# EAGLE design IFB-40001-R02 - I2C_Encoder (EAGLE 9.6.2)
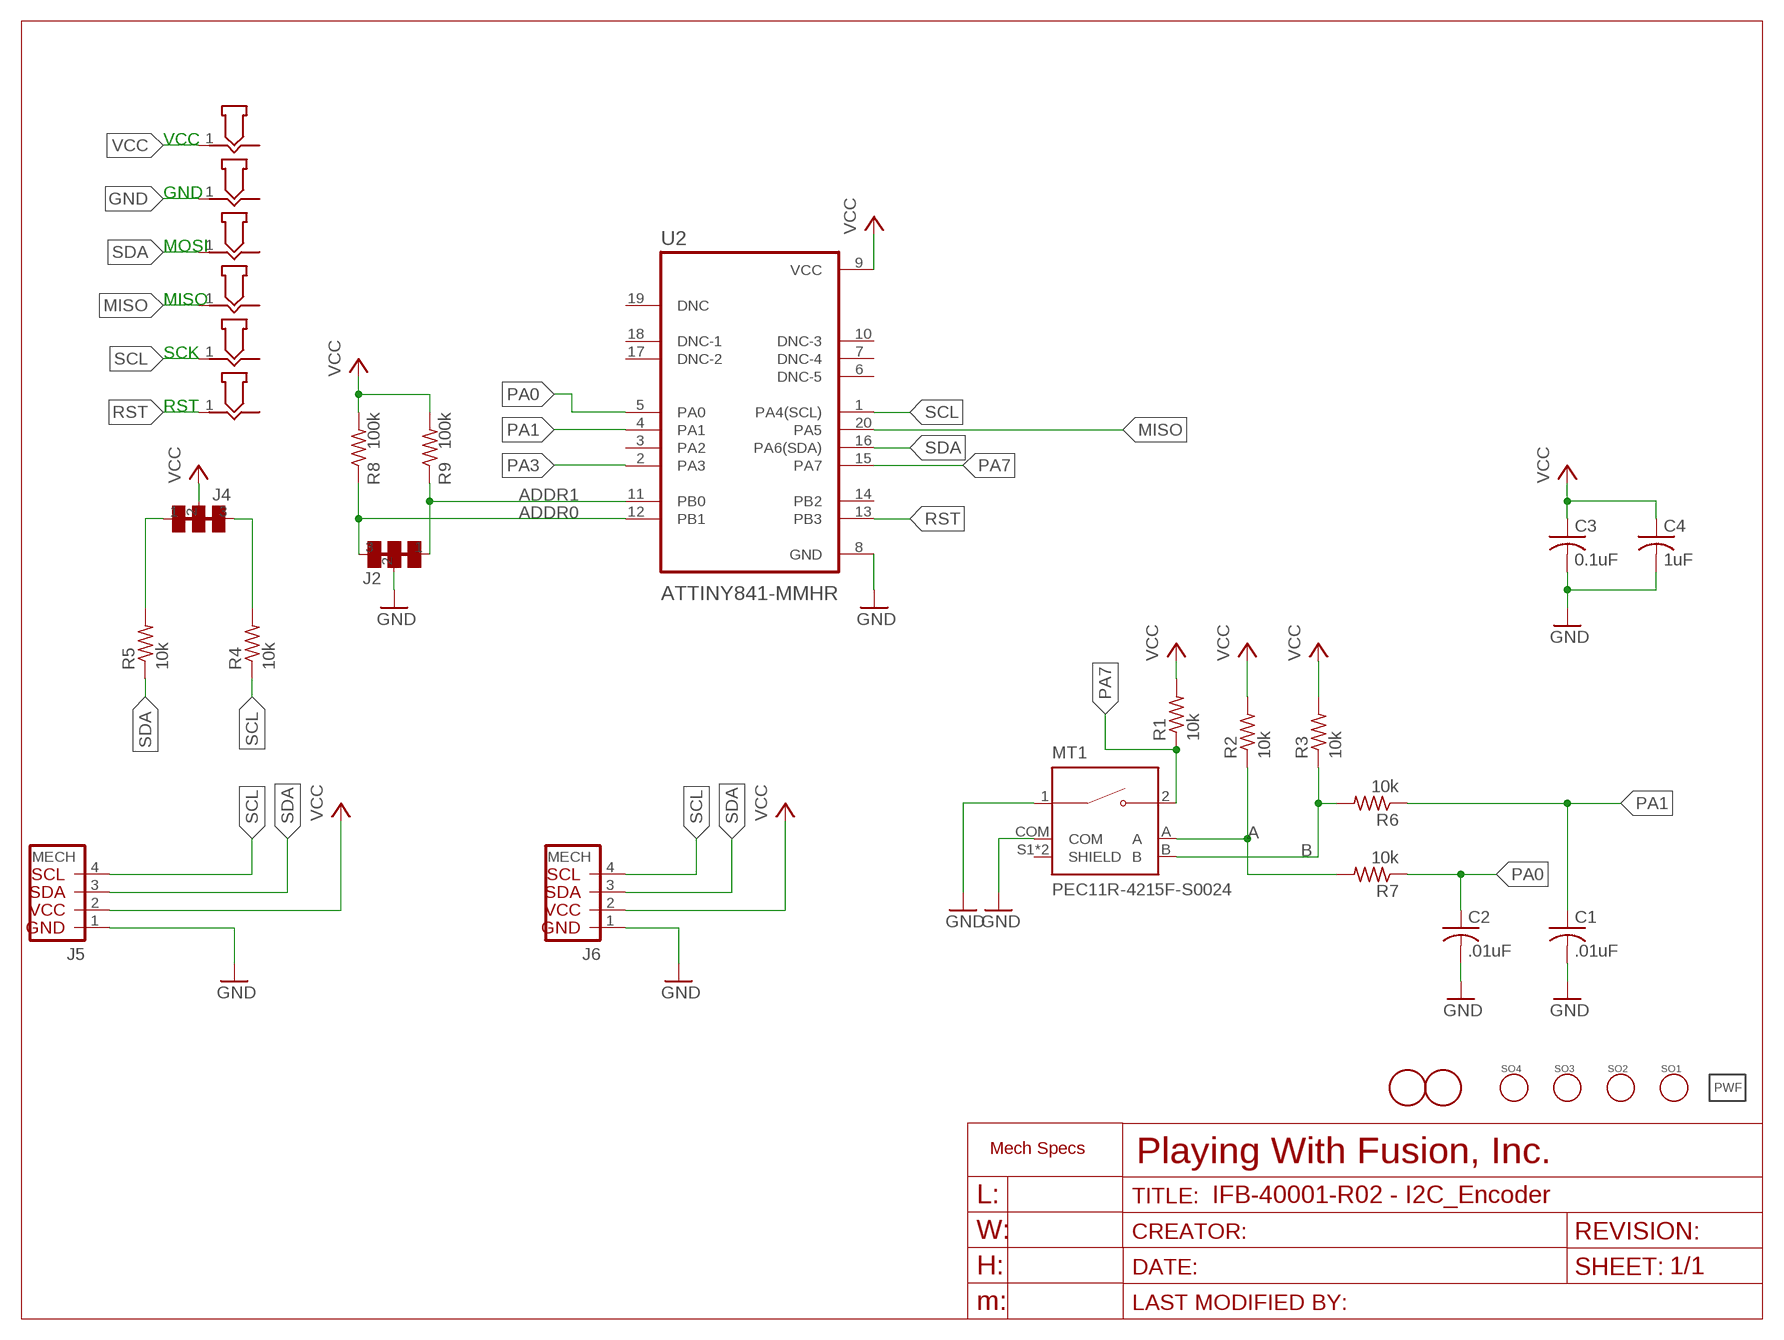
[diagram p0: schematic, sheet 1]

## Parts
C1  .01uF  C-USC0603K  [C0603K]
C2  .01uF  C-USC0603K  [C0603K]
C3  0.1uF  C-USC0603K  [C0603K]
C4  1uF  C-USC0603K  [C0603K]
GND  POGO_PAD  [P50_POGO_BOARD_CONTACT_12MIL]
J2  CUT_JUMPER_2X  [SMT_2X_CUTTABLE_JUMPER]
J4  CUT_JUMPER_2X  [SMT_2X_CUTTABLE_JUMPER]
J5  QWIICSIDE  [SM04B-SRSS-TB]
J6  QWIICSIDE  [SM04B-SRSS-TB]
LOGO1  PWF_LOGOPWF-5MM-SS  [LOGO_5MM_STEIN]
MISO  POGO_PAD  [P50_POGO_BOARD_CONTACT_12MIL]
MOSI  POGO_PAD  [P50_POGO_BOARD_CONTACT_12MIL]
MT1  PEC11R-4215F-S0024  [XDCR_PEC11R-4215F-S0024]
R1  10k  R-US_R0603  [R0603]
R2  10k  R-US_R0603  [R0603]
R3  10k  R-US_R0603  [R0603]
R4  10k  R-US_R0603  [R0603]
R5  10k  R-US_R0603  [R0603]
R6  10k  R-US_R0603  [R0603]
R7  10k  R-US_R0603  [R0603]
R8  100k  R-US_R0603  [R0603]
R9  100k  R-US_R0603  [R0603]
RST  POGO_PAD  [P50_POGO_BOARD_CONTACT_12MIL]
SCK  POGO_PAD  [P50_POGO_BOARD_CONTACT_12MIL]
SO1  STAND_OFFNO4_TIGHT  [STANDOFF_NO4_TIGHT]
SO2  STAND_OFFNO4_TIGHT  [STANDOFF_NO4_TIGHT]
SO3  STAND_OFFNO4_TIGHT  [STANDOFF_NO4_TIGHT]
SO4  STAND_OFFNO4_TIGHT  [STANDOFF_NO4_TIGHT]
U2  ATTINY841-MMHR  [QFN45P300X300X85-21N]
U$2  FIDUCIAL  [FIDUCIAL_1MM]
U$3  FIDUCIAL  [FIDUCIAL_1MM]
VCC  POGO_PAD  [P50_POGO_BOARD_CONTACT_12MIL]

## Nets
A: MT1.A R2.1 R7.2
ADDR0: J2.3 R8.1 U2.12(PB1)
ADDR1: J2.1 R9.1 U2.11(PB0)
B: MT1.B R3.1 R6.2
GND: C1.2 C2.2 C3.2 C4.2 GND.1 J2.2 J5.1 J6.1 MT1.1 MT1.COM U2.8(GND)
MISO: MISO.1 U2.20(PA5)
N$1: J4.1 R5.2
N$2: J4.3 R4.2
PA0: C2.1 R7.1 U2.5(PA0)
PA1: C1.1 R6.1 U2.4(PA1)
PA3: U2.2(PA3)
PA7: MT1.2 R1.1 U2.15(PA7)
RST: RST.1 U2.13(PB3)
SCL: J5.4 J6.4 R4.1 SCK.1 U2.1(PA4(SCL))
SDA: J5.3 J6.3 MOSI.1 R5.1 U2.16(PA6(SDA))
VCC: C3.1 C4.1 J4.2 J5.2 J6.2 R1.2 R2.2 R3.2 R8.2 R9.2 U2.9(VCC) VCC.1
Unconnected: J5.MECH1(MECH) J5.MECH2(MECH) J6.MECH1(MECH) J6.MECH2(MECH) MT1.S1(SHIELD) MT1.S2(SHIELD) U2.3(PA2) U2.6(DNC-5) U2.7(DNC-4) U2.10(DNC-3) U2.14(PB2) U2.17(DNC-2) U2.18(DNC-1) U2.19(DNC)

## Notes on the sheet
- VCC
- GND
- MOSI
- MISO
- SCK
- RST

## Library data of the parts
C1-C4 = rcl:C-US: CAPACITOR, American symbol; SPICEPREFIX: C
GND MISO MOSI RST SCK VCC = PlayingWithFusion_Breakout-Lib:POGO_PAD
J2 J4 = PlayingWithFusion_Breakout-Lib:CUT_JUMPER_2X
J5 J6 = PlayingWithFusion_JST:QWIIC
LOGO1 = PlayingWithFusion_Logo:PWF_LOGO
MT1 = PlayingWithFusion_Bourns:PEC11R-4215F-S0024: Incremental Encoder, 12 Mm, Contact Rating 10 Ma - 5 Vdc Check availability <https://pricing.snapeda.com/parts/PEC11R-4215F-S0024/Bourns/view-part?ref=eda>; AVAILABILITY: In Stock; DESCRIPTION: Rotary Encoder Mechanical 24 Quadrature (Incremental) Vertical; MF: Bourns; MP: PEC11R-4215F-S0024; PACKAGE: None; PRICE: None; PURCHASE-URL: https://pricing.snapeda.com/search/part/PEC11R-4215F-S0024/?ref=eda
R1-R9 = rcl:R-US_: RESISTOR, American symbol; SPICEPREFIX: R
SO1-SO4 = PlayingWithFusion_Breakout-Lib:STAND_OFF: Stand Off This is the mechanical footprint for a #4 phillips button head screw. Use the keepout ring to avoid running the screw head into surrounding components. SKU : PRT-00447
U2 = ATTINY841-MMHR:ATTINY841-MMHR: None Check availability <https://pricing.snapeda.com/parts/ATTINY841-MMHR/Microchip/view-part?ref=eda>; AVAILABILITY: In Stock; DESCRIPTION: AVR AVR® ATtiny Microcontroller IC 8-Bit 16MHz 8KB (8K x 8) FLASH 20-VQFN (3x3); MF: Microchip; MP: ATTINY841-MMHR; PACKAGE: DFN-20 Microchip; PRICE: None; PURCHASE-URL: https://pricing.snapeda.com/search/part/ATTINY841-MMHR/?ref=eda
U$2 U$3 = PlayingWithFusion_Breakout-Lib:FIDUCIAL: For use by pick and place machines to calibrate the vision/machine, 1mm By microbuilder.eu

## Board
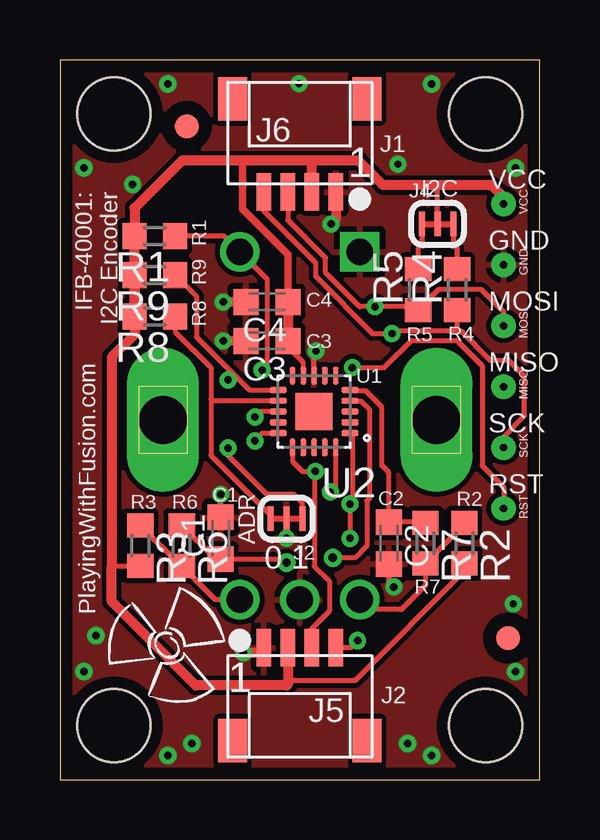
[diagram p1: board, top side]
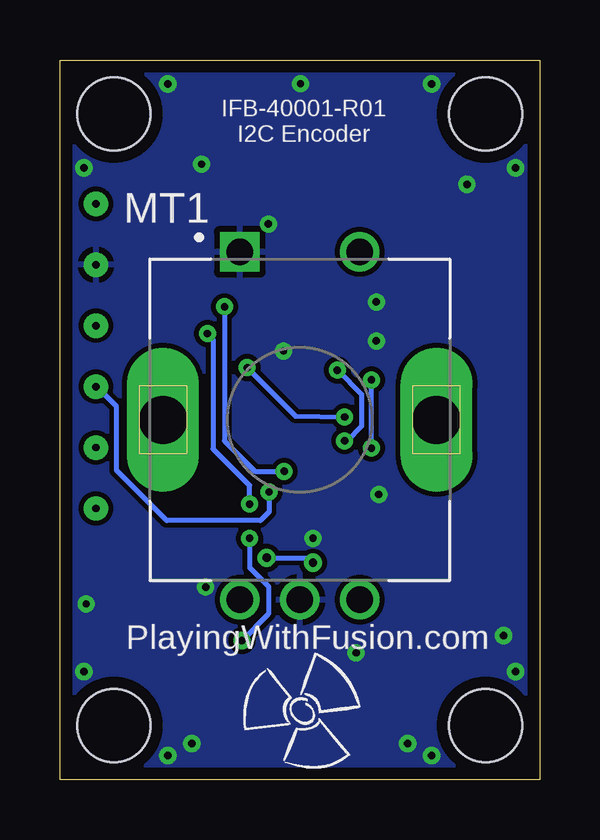
[diagram p2: board, bottom side, seen from below]

Size 20 x 30 mm. Coordinates in mm from the lower left corner, seen from the top.
Outline: 0,0 20,0 20,30 0,30 0,0
Copper layers (1*16): Top 0.035mm / dielectric 1.5mm / Bottom 0.035mm
Design rules "default *": minimum track width 8mil, minimum drill 12mil, track to track 8mil, track to pad 8mil, pad to pad 8mil, via to via 8mil, smd to smd 8mil, copper to edge 20mil, drill to drill 6mil, minimum pad ring 10mil, minimum via ring 8mil, stop-mask expansion 4mil, vias tented up to drill 17mil, thermal gap 10mil

### Footprints (pad centres in the part's own frame; a part is rotated, then mirrored left to right if it is on the bottom)
C0603K = smd 1.05 x 1.08: 1 -0.875,0; 2 0.875,0
P50_POGO_BOARD_CONTACT_12MIL = drill 0.305 pad 1.016: 1 0,0
SMT_2X_CUTTABLE_JUMPER = smd 0.254 x 1.016: 1 -0.66,0; 2 0,0; 3 0.66,0
SM04B-SRSS-TB = smd 0.6 x 1.55: 1 1.5,0; 2 0.5,0; 3 -0.5,0; 4 -1.5,0 | smd 1.2 x 1.8: MECH1 2.8,3.875; MECH2 -2.8,3.875
XDCR_PEC11R-4215F-S0024 = drill 1.1 square: 1 -2.5,7 | drill 1.1: 2 2.5,7; A -2.5,-7.5; B 2.5,-7.5; COM 0,-7.5 | drill 2 long: S1 -5.7,0; S2 5.7,0
R0603 = smd 1 x 1.1: 1 -0.85,0; 2 0.85,0
STANDOFF_NO4_TIGHT = hole 3.048: 0,0
QFN45P300X300X85-21N = smd 0.72 x 0.24: 1 -1.495,0.9; 2 -1.495,0.45; 3 -1.495,0; 4 -1.495,-0.45; 5 -1.495,-0.9; 11 1.495,-0.9; 12 1.495,-0.45; 13 1.495,0; 14 1.495,0.45; 15 1.495,0.9 | smd 0.24 x 0.72: 6 -0.9,-1.495; 7 -0.45,-1.495; 8 0,-1.495; 9 0.45,-1.495; 10 0.9,-1.495; 16 0.9,1.495; 17 0.45,1.495; 18 0,1.495; 19 -0.45,1.495; 20 -0.9,1.495 | smd 1.55 x 1.55: 21 0,0
FIDUCIAL_1MM = smd 1 x 1: 1 0,0

### Placement (x,y rotation side)
C1  6.71,10.06 90 top
C2  13.72,9.86 270 top
C3  8.64,18.29 180 top
C4  8.64,19.91 180 top
GND  18.5,21.46 0 top
J2  9.45,10.87 180 top
J4  15.75,23.16 0 top
J5  10,5.5 180 top
J6  10,24.5 0 top
LOGO1  4.44,5.61 0 top
LOGO2  PWF_LOGOPWF-6MM-SS  [LOGO_5MM_STEIN]  9.92,2.87 0 bottom
MISO  18.5,16.38 0 top
MOSI  18.5,18.92 0 top
MT1  10,15 0 bottom
R1  3.96,22.66 180 top
R2  16.87,9.86 270 top
R3  3.35,9.75 270 top
R4  16.56,20.42 90 top
R5  14.94,20.42 90 top
R6  5.08,9.75 270 top
R7  15.24,9.86 270 top
R8  3.96,19.3 180 top
R9  3.96,21.03 180 top
RST  18.5,11.3 0 top
SCK  18.5,13.84 0 top
SO1  17.75,2.25 0 top
SO2  2.25,2.25 0 top
SO3  2.25,27.75 0 top
SO4  17.75,27.75 0 top
U2  10.6,15.34 180 top
U$2  5.28,27.23 0 top
U$3  18.69,5.89 0 top
VCC  18.5,24 0 top

### Tracks (layer width: path | path; a pad name or v marks a point on that pad's centre or on a via)
A
  Top 0.203: R2.1 16.87,10.63 R7.2 15.24,8.09 14.24,7.09 12.91,7.09 MT1.A
ADDR0
  Top 0.203: J2.3 8.79,11.02 6.3,13.51 6.3,15.85 | R8.1 4.81,18.66 6.3,17.17 6.3,15.85 | 6.3,15.85 6.36,15.79 U2.12
ADDR1  (via drill 0.3)
  Top 0.203: R9.1 5.69,20.15 5.69,18.46 7.25,16.9 | 7.25,16.9 7.9,16.24 U2.11 | J2.1 10.11,11.53 9.75,11.89 8.64,11.89 7.01,13.51 v7.01,13.82 | v7.01,16.66 7.25,16.9
  Bottom 0.203: v7.01,13.82 v7.01,16.66
B
  Top 0.203: R3.1 5.05,8.9 R6.2 6.48,7.5 MT1.B
GND  (via drill 0.3)
  Top 0.203: U2.8 10.6,17.78 v10.68,17.86 | C1.2 v6.71,11.89 | v13.92,8.03 13.72,8.23 C2.2 | J2.2 v9.45,10.06
  Top 0.406: C4.2 v6.81,19.91 | C3.2 v6.81,18.29 | v11.31,23.16 11.5,23.36 J6.1 | J5.1 8.28,5.28 v7.65,5.28
  other vias: 1,25.5 3.02,24.81 4.5,29 9.97,29.01 15.5,29 14.09,25.66 19,25.5 1.5,6 1,4.5 4.5,1 5.5,1.5 15.5,1 14.5,1.5 19,4.5 18.91,7.32
  pour Bottom: 0,30 0,0 20,0 20,30
  pour Top: 0,30 0,0 20,0 20,30
MISO  (via drill 0.3)
  Top 0.203: U2.20 11.5,12.21 v11.28,11.99
  Bottom 0.203: v11.28,11.99 11.28,11.16 11.64,10.8 15.55,10.8 17.64,12.89 17.64,15.55 18.47,16.38 MISO.1
N$1
  Top 0.203: J4.1 15.09,22.3 14.94,22.15 R5.2
N$2
  Top 0.203: J4.3 16.41,22.3 16.56,22.15 R4.2
PA0
  Top 0.203: U2.5 12.12,16.22 12.74,16.22 13.41,15.54 13.41,13.11 13.72,12.8 C2.1 15.21,10.73 R7.1
PA1  (via drill 0.35)
  Top 0.203: R6.1 6.5,9.18 C1.1 9.31,9.18 v9.45,9.04 | U2.4 12.12,15.77 12.58,15.77 12.9,15.44 12.9,11.72 12.8,11.62 12.8,9.75 12.29,9.25 v11.38,9.25
  Bottom 0.203: v9.45,9.04 9.65,9.25 v11.38,9.25
PA7  (via drill 0.3)
  Top 0.203: R1.1 6.84,22.66 MT1.2 8.64,20.86 8.64,17.27 v8.43,17.07 | v8.13,14.12 8.45,14.44 U2.15
  Bottom 0.203: v8.43,17.07 7.42,16.05 7.42,14.73 8.03,14.12 v8.13,14.12
RST  (via drill 0.3)
  Top 0.203: U2.13 8.33,15.34 v8.13,15.11 | RST.1 18.5,12.18 17.61,13.08 17.61,17.25 16.55,18.3 14.65,18.3 13.51,17.17 v12.19,17.17
  Bottom 0.203: v12.19,17.17 10.18,15.16 v8.13,15.11
SCL  (via drill 0.3)
  Top 0.203: U2.1 12.2,14.33 12.2,11.67 12.09,11.56 v12.09,11.48 v12.09,10.06 | v12.41,5.79 12.12,5.5 J5.4 | SCK.1 18.5,14.3 19.37,15.17 19.37,16.83 18.73,17.48 17.95,17.48 16.72,18.71 16.62,18.71 | 16.62,18.71 13.97,18.71 v13.85,18.59 13.04,18.59 10.67,20.96 10.67,21.54 8.5,23.71 J6.4 | R4.1 16.56,18.77 16.62,18.71
  Bottom 0.203: v13.85,18.59 13.62,18.36 13.62,13.79 12.09,12.26 v12.09,11.48 | v12.09,10.06 12.09,8.84 11.29,8.04 11.29,6.91 v12.41,5.79
SDA  (via drill 0.3)
  Top 0.203: J5.3 10.5,6.3 11.23,7.03 11.23,8.27 10.61,8.89 10.61,12.82 v10.65,12.85 10.11,12.85 9.7,13.26 U2.16 | MOSI.1 18.5,19.5 17.58,20.42 15.79,20.42 R5.1 14.8,19.71 v13.14,19.71 12.5,19.71 11.07,21.13 11.07,21.74 9.5,23.32 J6.3
  Bottom 0.203: v13.14,19.71 13.14,14.12 11.87,12.85 v10.65,12.85
VCC
  Top 0.203: R2.2 16.87,8.69 12.29,4.12 9.57,4.12 9.51,4.06 | R3.2 3.34,8.89 2.17,8.89 | J4.2 15.75,24.79 | U2.9 10.15,17.39 9.51,18.02 C3.1 | 5.98,25.79 5.99,25.81
  Top 0.305: C4.1 9.51,21.88 7.62,23.77 7.62,25.81
  Top 0.406: J6.2 10.5,25.81 | 10.5,25.81 7.62,25.81 5.99,25.81 5.09,25.81 3.11,23.82 R1.2 R9.2 | C4.1 C3.1 | J5.2 9.51,4.06 9.51,3.96 9.47,3.92 5.66,3.92 2.17,7.42 2.17,8.89 2.17,17.61 3.11,18.56 R9.2 | VCC.1 18.5,24.27 17.98,24.79 15.75,24.79 13.47,24.79 12.46,25.81 10.5,25.81 | R8.2 R9.2

### Text on the board
tPlace: J1 | IFB-40001: / I2C Encoder | I2C | VCC | R1 | R9 | GND | C4 | R8 | C3 | R5 | R4 | MOSI | PlayingWithFusion.com | U1 | MISO | SCK | C1 | R3 | R6 | ADR | C2 | R2 | RST | 0 1 | R7 | J2
bPlace: IFB-40001-R01 / I2C Encoder | PlayingWithFusion.com